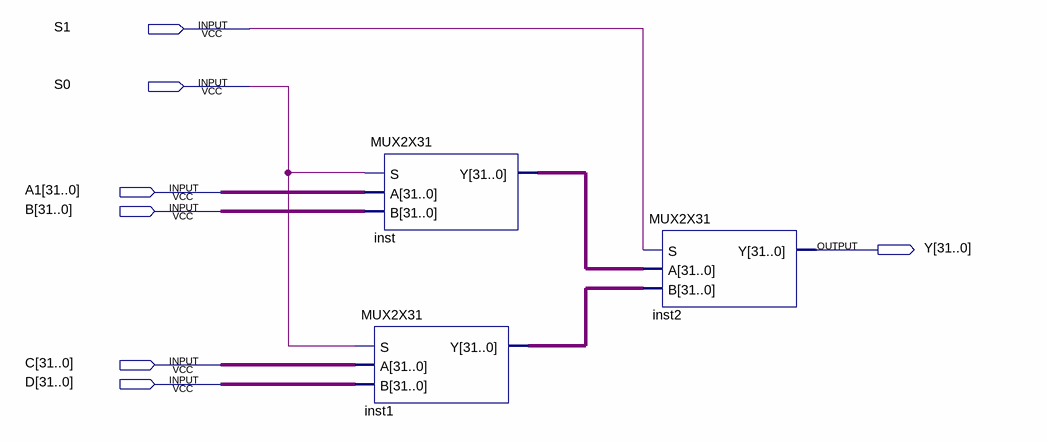
[diagram p0: schematic sheet]
// Quartus schematic MUX4X1_32bits.bdf as structural Verilog: 3 symbols, 7 pins
module MUX4X1_32bits (
  input  S1,
  input  S0,
  input  [31:0] A1,
  input  [31:0] B,
  input  [31:0] C,
  input  [31:0] D,
  output [31:0] Y
);

  wire [31:0] inst1_y, inst_y;

  MUX2X31 inst (.S(S0), .A(A1), .B(B), .Y(inst_y));
  MUX2X31 inst1 (.S(S0), .A(C), .B(D), .Y(inst1_y));
  MUX2X31 inst2 (.S(S1), .A(inst_y), .B(inst1_y), .Y(Y));
endmodule
